# EAGLE design Controller (EAGLE 9.2.2)
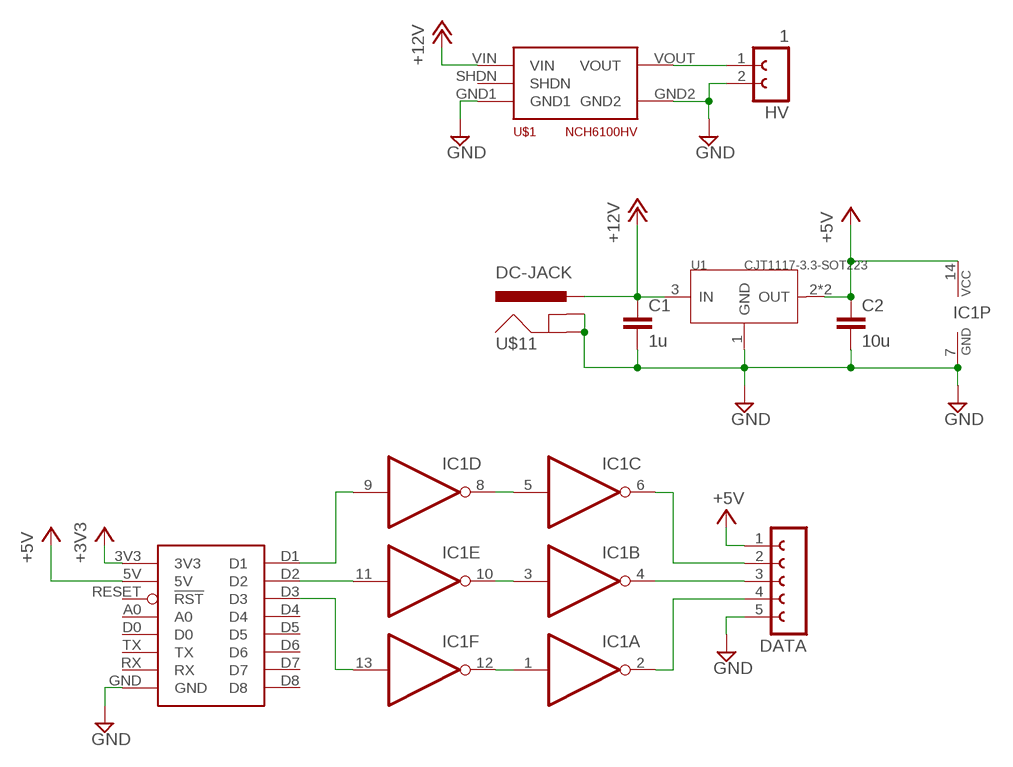
[diagram p0: schematic, sheet 1]

## Parts
C1  1u  C-EUC0603K  [C0603K]
C2  10u  C-EUC0603K  [C0603K]
DATA  FE05W  [FE05W]
HV  1  FE02W  [FE02W]
IC1  74HCT04D  [SO-14]
U1  CJT1117-3.3-SOT223  PMIC-CJT1117-3.3(SOT223)  [SOT-223]
U$1  NCH6100HV  [NCH6100HV]
U$11  DC-JACK  [POWER_JACK_PTH]
U$12  WEMOS-D1  [WEMOS-D1-MINI]

## Nets
+3V3: U$12.3V3
+5V: C2.1 DATA.1 IC1.14(P:VCC) U1.2(OUT) U1.TER(OUT) U$12.5V
+12V: C1.1 U1.3(IN) U$1.VIN U$11.PWR
GND: C1.2 C2.2 DATA.5 HV.2 IC1.7(P:GND) U1.1(GND) U$1.GND1 U$1.GND2 U$11.GND U$11.GNDBREAK U$12.GND
N$1: HV.1 U$1.VOUT
N$2: IC1.5(C:I) IC1.8(D:O)
N$3: IC1.3(B:I) IC1.10(E:O)
N$4: IC1.1(A:I) IC1.12(F:O)
N$6: DATA.3 IC1.4(B:O)
N$7: IC1.13(F:I) U$12.D3
N$8: DATA.4 IC1.2(A:O)
N$60: DATA.2 IC1.6(C:O)
N$62: IC1.9(D:I) U$12.D1
N$63: IC1.11(E:I) U$12.D2
Unconnected: U$1.SHDN U$12.A0 U$12.D0 U$12.D4 U$12.D5 U$12.D6 U$12.D7 U$12.D8 U$12.RESET(!RST) U$12.RX U$12.TX

## Library data of the parts
C1 C2 = rcl:C-EU: CAPACITOR, European symbol; SPICEPREFIX: C
DATA = NixieClock:FE05W: FEMALE HEADER
HV = NixieClock:FE02W: FEMALE HEADER
IC1 = NixieClock:74HCT04: Hex INVERTER
U1 = NixieClock:PMIC-CJT1117-3.3(SOT223): 310030097; MPN: CJT1117-3.3
U$1 = NixieClock:NCH6100HV
U$11 = Parts:DC-JACK
U$12 = NixieClock:WEMOS-D1

## Board
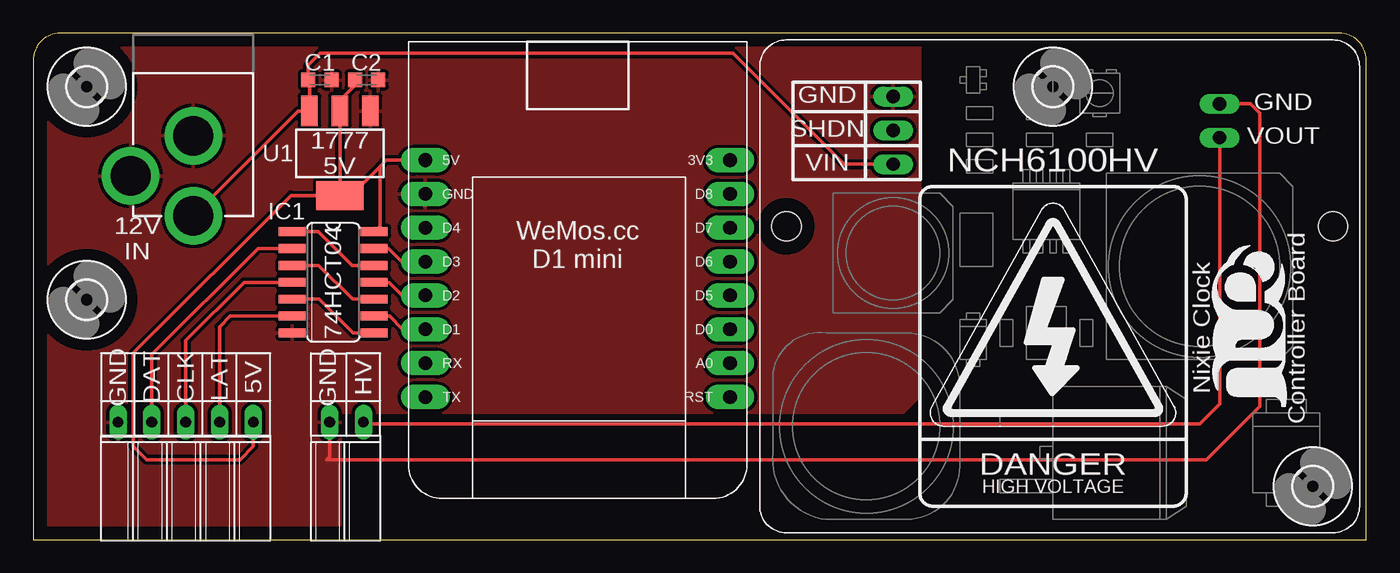
[diagram p1: board, top side]
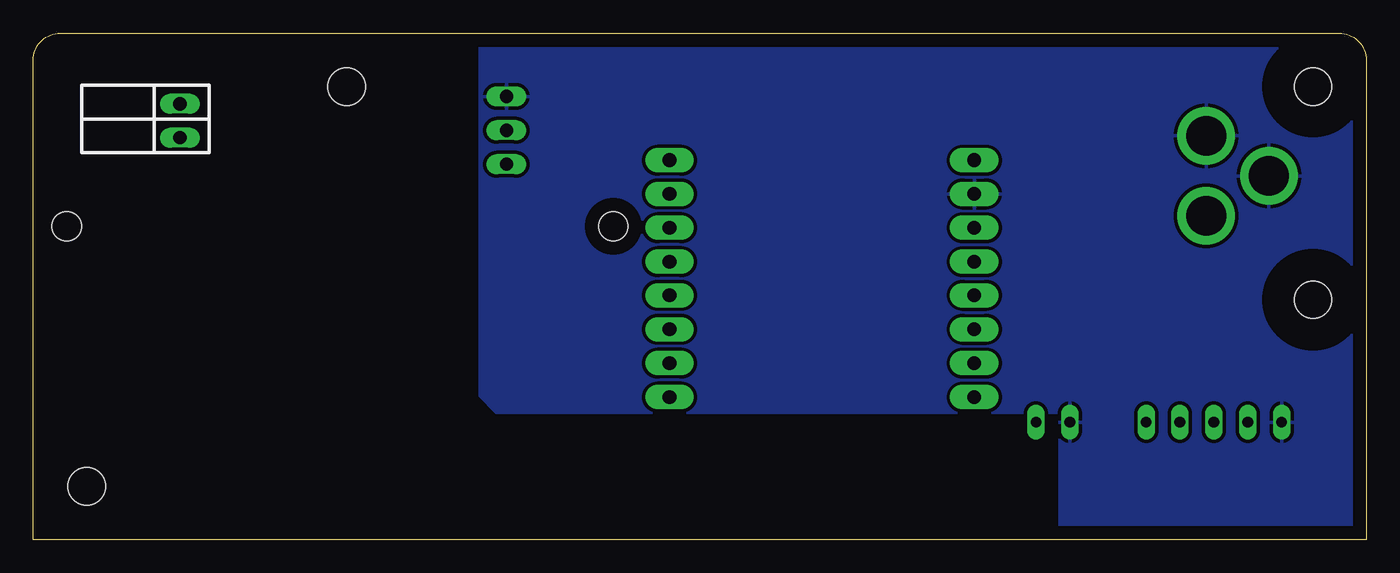
[diagram p2: board, bottom side, seen from below]

Size 100 x 38 mm. Coordinates in mm from the lower left corner, seen from the top.
Outline: 100,36 arc90 98,38 2,38 arc90 0,36 0,0 100,0 100,36
Copper layers (1*16): Top 0.035mm / dielectric 1.5mm / Bottom 0.035mm
Design rules "default *": minimum track width 6mil, minimum drill 0.35mm, track to track 6mil, track to pad 6mil, pad to pad 6mil, via to via 6mil, smd to smd 6mil, copper to edge 40mil, drill to drill 6mil, minimum pad ring 10mil, minimum via ring 8mil, stop-mask expansion 4mil, vias tented up to drill 40mil, thermal gap 10mil

### Footprints (pad centres in the part's own frame; a part is rotated, then mirrored left to right if it is on the bottom)
C0603K = smd 1.05 x 1.08: 1 -0.875,0; 2 0.875,0
FE05W = drill 0.813 long: 1 -5.08,0; 2 -2.54,0; 3 0,0; 4 2.54,0; 5 5.08,0
FE02W = drill 0.813 long: 1 -1.27,0; 2 1.27,0
SO-14 = smd 0.66 x 2.032: 1 -3.81,-3.073; 2 -2.54,-3.073; 3 -1.27,-3.073; 4 0,-3.073; 5 1.27,-3.073; 6 2.54,-3.073; 7 3.81,-3.073; 8 3.81,3.073; 9 2.54,3.073; 10 1.27,3.073; 11 0,3.073; 12 -1.27,3.073; 13 -2.54,3.073; 14 -3.81,3.073
SOT-223 = smd 1.27 x 2.286: 1 -2.286,-3.175; 2 0,-3.175; 3 2.286,-3.175 | smd 3.556 x 2.159: TER 0,3.175
NCH6100HV = drill 1 long: GND1 10,-4.25; GND2 34.5,-4.8; SHDN 10,-6.79; VIN 10,-9.33; VOUT 34.5,-7.34 | hole 2.2: 2,-14; 43,-14
2,8 = hole 2.8: 0,0
POWER_JACK_PTH = drill 2.997 pad 4.318: GND 0,7.7; GNDBREAK 4.7,10.7; PWR 0,13.7
WEMOS-D1-MINI = drill 1.016 pad 1.829 long: 3V3 -11.43,-12.7; 5V 11.43,-12.7; A0 -11.43,2.54; D0 -11.43,0; D1 11.43,0; D2 11.43,-2.54; D3 11.43,-5.08; D4 11.43,-7.62; D5 -11.43,-2.54; D6 -11.43,-5.08; D7 -11.43,-7.62; D8 -11.43,-10.16; GND 11.43,-10.16; RESET -11.43,5.08; RX 11.43,2.54; TX 11.43,5.08

### Placement (x,y rotation side)
C1  21.5,34.5 0 top
C2  25,34.5 0 top
DATA  11.43,8.81 180 top
HV  23.5,8.81 180 top
IC1  22.5,19.31 270 top
U1  23,29 180 top
U$1  54.5,37.51 0 top
U$2  [LOGO-SILKSCREEN]  92.25,15.89 90 top
U$3  [2,8]  96,4 0 top
U$4  [2,8]  4,18 0 top
U$5  [2,8]  4,34 0 top
U$6  [2,8]  76.5,34 0 top
U$11  12,38 180 top
U$12  40.84,15.78 180 top

### Tracks (layer width: path | path; a pad name or v marks a point on that pad's centre or on a via)
+5V
  Top 0.254: U1.TER 23,25 26,28 | 26,28 26,23.55 IC1.14 | U1.TER U1.2 23,33 24.12,34.12 C2.1 | U$12.5V 26.48,28.48 26,28 | DATA.1 16.51,7.01 15.5,6 8.5,6 7.5,7 7.5,14 19.32,25.82 U1.TER
+12V
  Top 0.254: U$1.VIN 60.82,28.18 52.5,36.5 21.5,36.5 20.62,35.62 C1.1 20.71,34.41 U1.3 19.88,32.17 U$11.PWR
GND
  Top 0.254: U$1.GND2 91.29,32.71 92,32 92,10 88,6 22,6 22.23,6.22 HV.2
  pour Top (isolate 0.254): 0,0 0,38 65.5,38 66.5,37 66.5,10.77 65.27,9.54 23,9.54 23,1 22,0
  pour Bottom (isolate 0.254): 0,0 0,38 65.5,38 66.5,37 66.5,10.77 65.27,9.54 23,9.54 23,1 22,0
N$1
  Top 0.254: HV.1 24.91,8.81 25.04,8.69 87.5,8.69 89,10.19 U$1.VOUT
N$2
  Top 0.254: IC1.8 24,15.5 21.46,18.04 IC1.5
N$3
  Top 0.254: IC1.10 23.96,18.04 21.42,20.58 IC1.3
N$4
  Top 0.254: IC1.12 23.92,20.58 21.38,23.12 IC1.1
N$6
  Top 0.254: IC1.4 15.81,19.31 11.43,14.93 DATA.3
N$7
  Top 0.254: U$12.D3 27.64,20.86 26.65,21.85 IC1.13
N$8
  Top 0.254: IC1.2 16.85,21.85 8.89,13.89 DATA.4
N$60
  Top 0.254: IC1.6 14.77,16.77 13.97,15.97 DATA.2
N$62
  Top 0.254: U$12.D1 27.72,15.78 26.73,16.77 IC1.9
N$63
  Top 0.254: U$12.D2 27.68,18.32 26.69,19.31 IC1.11

### Text on the board
tPlace: 1777 / 5V | 12V / IN | 74HCT04 | Nixie Clock | Controller Board
tNames: NCH6100HV | GND | DAT | CLK | LAT | 5V | GND | HV